# Altium schematic sheet 11_USB3.1 x4 HUB.SchDoc: C200
size 439 x 311 mm; Page Create Date: March  8, 1995; Page Number: 11; Page Size: Custom; Comment: radxa_1010; Page Count: 21; RevCode: V1.11; Doc: 11_USB3.1 x4 HUB; DsnPath: D:\WMS\C200\CC122\对外\C200 V1.11.DSN; SchematicName: c200; PageName: 11_USB3.1 x4 HUB; PageSize: Custom; TopSchematic: True
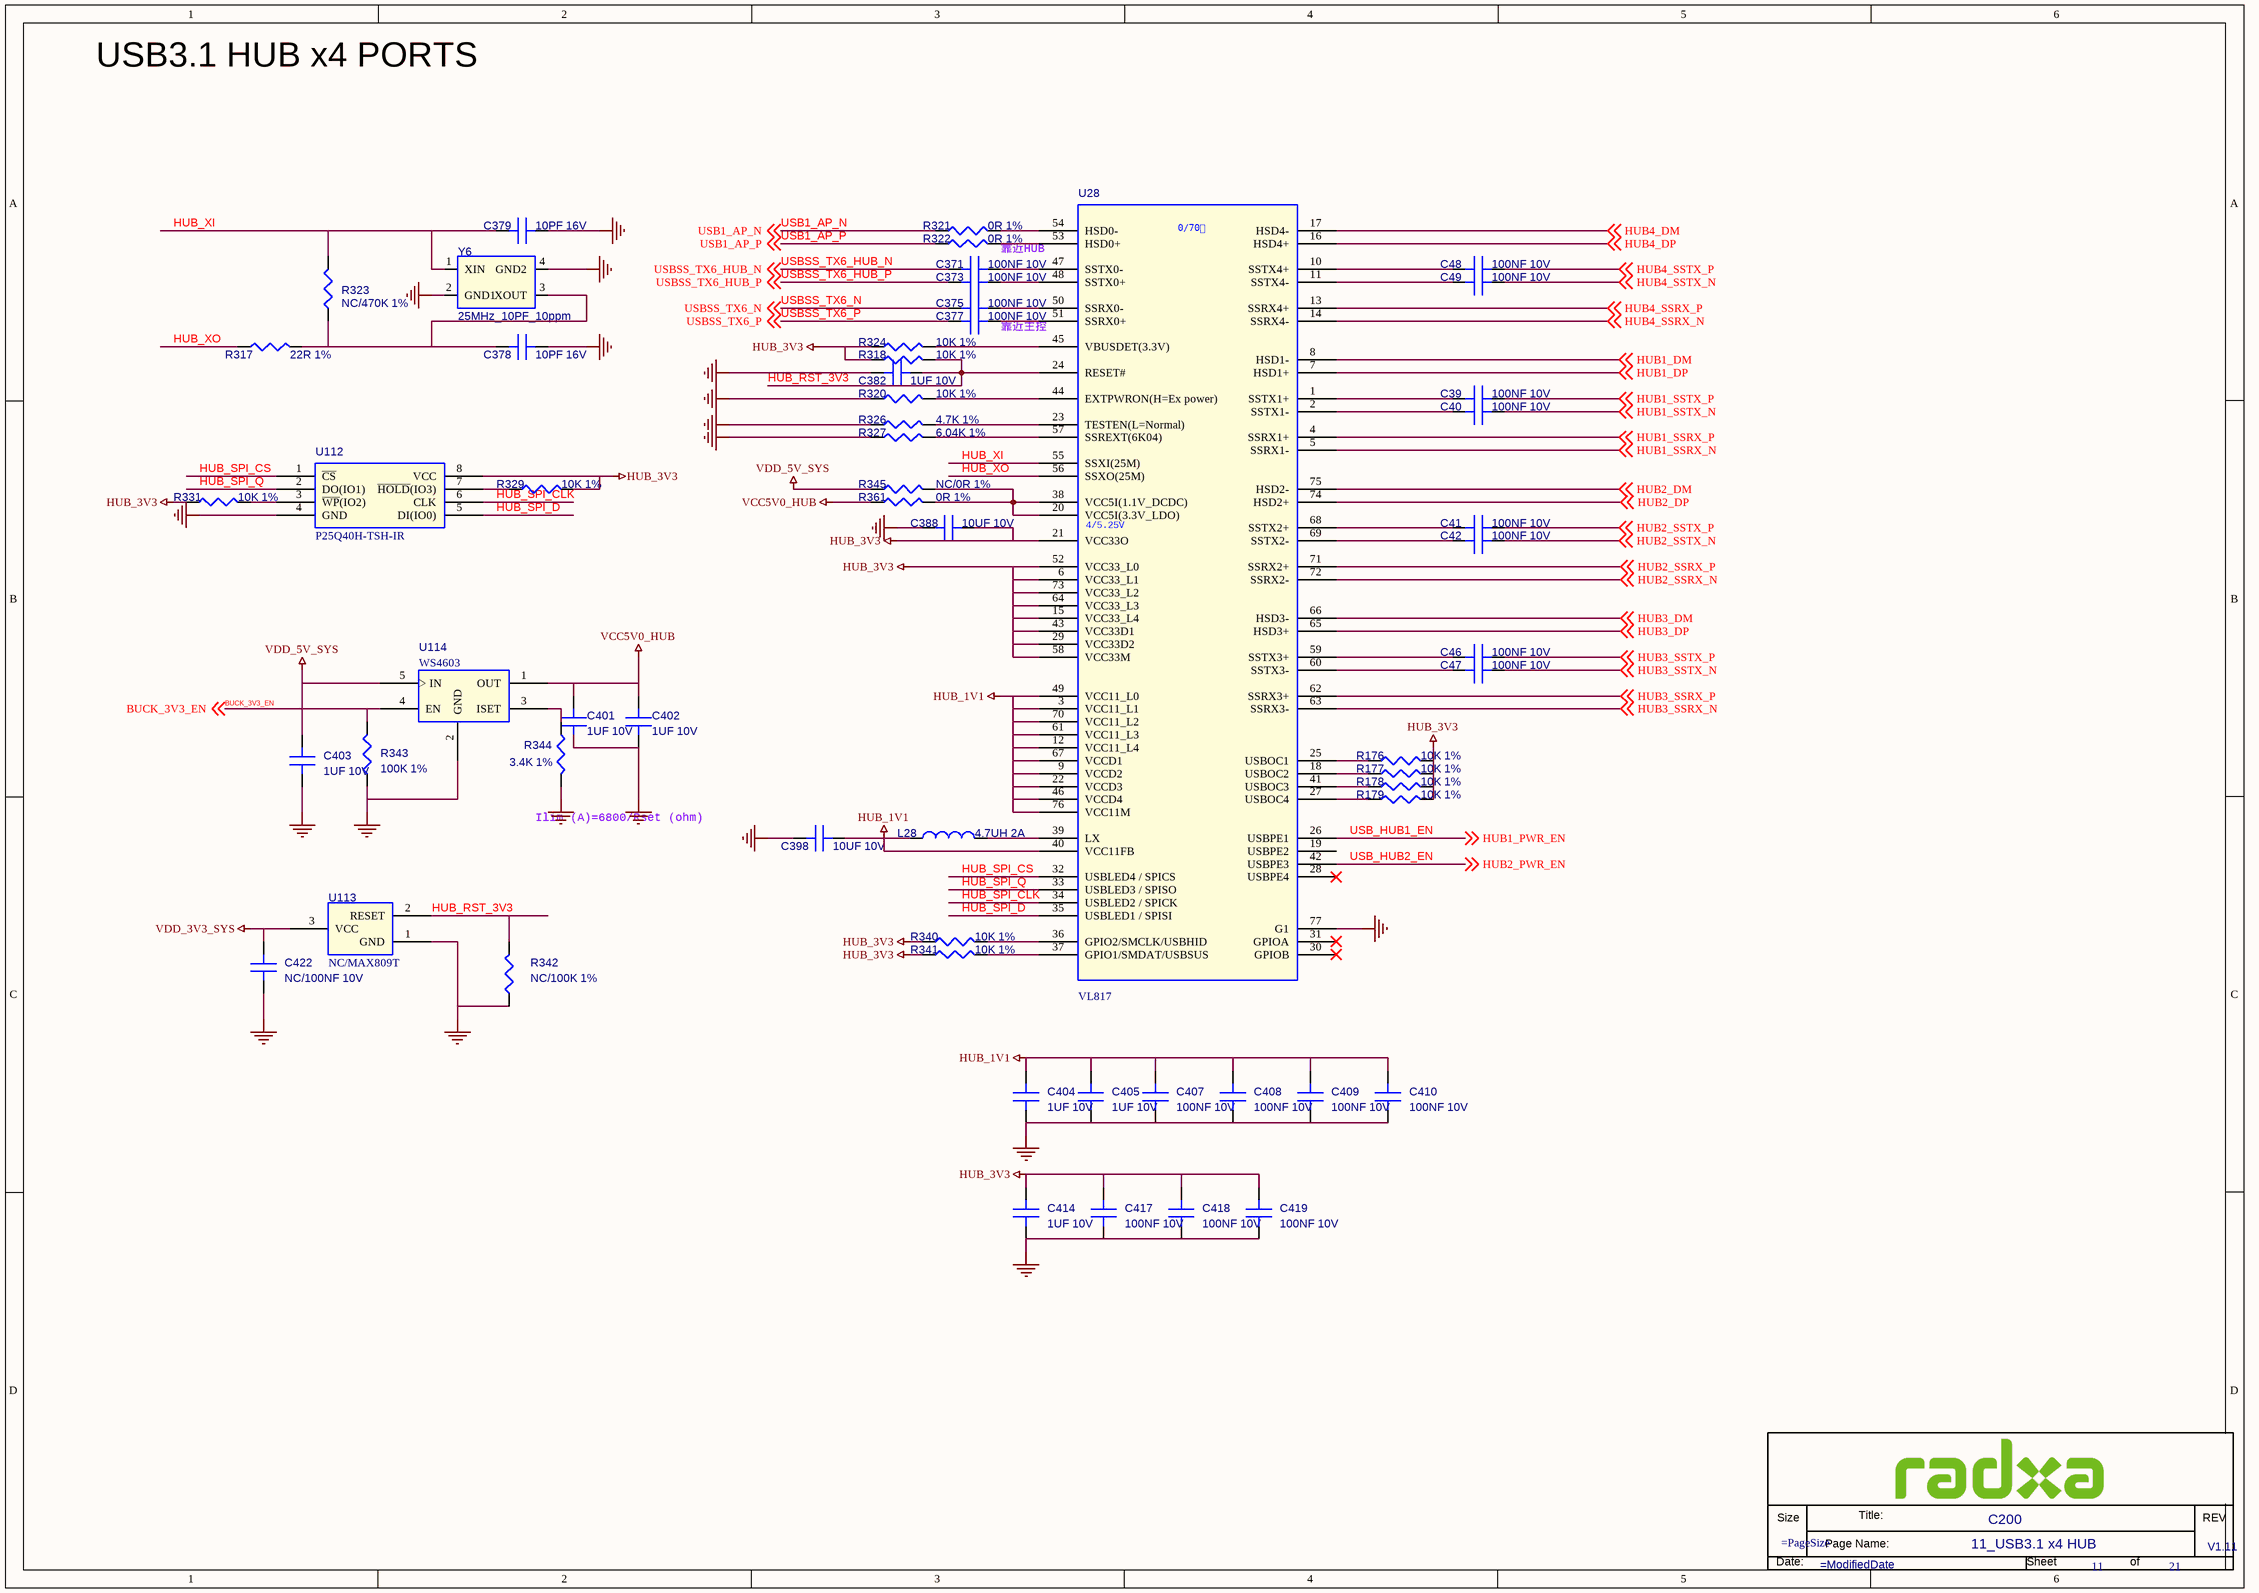
[diagram p0: 11_USB3.1 x4 HUB.SchDoc]

## Parts
*  Doc: 11_USB3.1 x4 HUB  RevCode: V1.11  Title: C200  Page Number: 11  Page Count: 21  (hidden comment: radxa_1010)  (graphical)
C39  100NF 10V  [C0402]
C40  100NF 10V  [C0402]
C41  100NF 10V  [C0402]
C42  100NF 10V  [C0402]
C46  100NF 10V  [C0402]
C47  100NF 10V  [C0402]
C48  100NF 10V  [C0402]
C49  100NF 10V  [C0402]
C371  100NF 10V  [C0402]
C373  100NF 10V  [C0402]
C375  100NF 10V  [C0402]
C377  100NF 10V  [C0402]
C378  10PF 16V  [C0402]
C379  10PF 16V  [C0402]
C382  1UF 10V  [C0402]
C388  10UF 10V  [C0603]
C398  10UF 10V  [C0603]
C401  1UF 10V  [C0402]
C402  1UF 10V  [C0402]
C403  1UF 10V  [C0402]
C404  1UF 10V  [C0402]
C405  1UF 10V  [C0402]
C407  100NF 10V  [C0402]
C408  100NF 10V  [C0402]
C409  100NF 10V  [C0402]
C410  100NF 10V  [C0402]
C414  1UF 10V  [C0402]
C417  100NF 10V  [C0402]
C418  100NF 10V  [C0402]
C419  100NF 10V  [C0402]
C422  NC/100NF 10V  [C0402]
L28  4.7UH 2A  [L_2520]
R176  10K 1%  [R0402]
R177  10K 1%  [R0402]
R178  10K 1%  [R0402]
R179  10K 1%  [R0402]
R317  22R 1%  [R0402]
R318  10K 1%  [R0402]
R320  10K 1%  [R0402]
R321  0R 1%  [R0402]
R322  0R 1%  [R0402]
R323  NC/470K 1%  [R0402]
R324  10K 1%  [R0402]
R326  4.7K 1%  [R0402]
R327  6.04K 1%  [R0402]
R329  10K 1%  [R0402]
R331  10K 1%  [R0402]
R340  10K 1%  [R0402]
R341  10K 1%  [R0402]
R342  NC/100K 1%  [R0402]
R343  100K 1%  [R0402]
R344  3.4K 1%  [R0402]
R345  NC/0R 1%  [R0402]
R361  0R 1%  [R0402]
U28  VL817  [QFN76E-PH04-9x9mm]
U112  P25Q40H-TSH-IR  [TSSOP8_0D65_4]
U113  NC/MAX809T  [SOT_23]
U114  WS4603  [SOT23_5]
Y6  25MHz_10PF_10ppm  [CRY-3225]

## Nets
GND: C378.1(A) C379.1(A) C382.1(A) C388.2(B) C398.2(B) C401.2(B) C402.2(B) C403.1(A) C404.2(B) C405.2(B) C407.2(B) C408.2(B) C409.2(B) C410.2(B) C414.2(B) C417.2(B) C418.2(B) C419.2(B) C422.2(B) R320.2 R326.2 R327.2 R342.2 R343.1 R344.1 U28.77(G1) U112.4(GND) U113.1(GND) U114.2(GND) Y6.2(GND1) Y6.4(GND2)
HUB_1V1: C398.1(A) C404.1(A) C405.1(A) C407.1(A) C408.1(A) C409.1(A) C410.1(A) L28.1 U28.3(VCC11_L1) U28.9(VCCD2) U28.12(VCC11_L4) U28.22(VCCD3) U28.40(VCC11FB) U28.46(VCCD4) U28.49(VCC11_L0) U28.61(VCC11_L3) U28.67(VCCD1) U28.70(VCC11_L2) U28.76(VCC11M)
HUB_3V3: C388.1(A) C414.1(A) C417.1(A) C418.1(A) C419.1(A) R176.2 R177.2 R178.2 R179.2 R318.2 R324.2 R329.1 R331.2 R340.2 R341.2 U28.6(VCC33_L1) U28.15(VCC33_L4) U28.21(VCC33O) U28.29(VCC33D2) U28.43(VCC33D1) U28.52(VCC33_L0) U28.58(VCC33M) U28.64(VCC33_L3) U28.73(VCC33_L2) U112.8(VCC)
VCC5V0_HUB: C401.1(A) C402.1(A) R361.2 U114.1(OUT)
VDD_3V3_SYS: C422.1(A) U113.3(VCC)
VDD_5V_SYS: C403.2(B) R345.2 U114.5(IN)
BUCK_3V3_EN: R343.2 U114.4(EN) ; off-sheet BUCK_3V3_EN
HUB1_DM: U28.8(HSD1-) ; off-sheet HUB1_DM
HUB1_DP: U28.7(HSD1+) ; off-sheet HUB1_DP
HUB1_SSRX_N: U28.5(SSRX1-) ; off-sheet HUB1_SSRX_N
HUB1_SSRX_P: U28.4(SSRX1+) ; off-sheet HUB1_SSRX_P
HUB1_SSTX_N: C40.2(B) ; off-sheet HUB1_SSTX_N
HUB1_SSTX_P: C39.2(B) ; off-sheet HUB1_SSTX_P
HUB2_DM: U28.75(HSD2-) ; off-sheet HUB2_DM
HUB2_DP: U28.74(HSD2+) ; off-sheet HUB2_DP
HUB2_SSRX_N: U28.72(SSRX2-) ; off-sheet HUB2_SSRX_N
HUB2_SSRX_P: U28.71(SSRX2+) ; off-sheet HUB2_SSRX_P
HUB2_SSTX_N: C42.2(B) ; off-sheet HUB2_SSTX_N
HUB2_SSTX_P: C41.2(B) ; off-sheet HUB2_SSTX_P
HUB3_DM: U28.66(HSD3-) ; off-sheet HUB3_DM
HUB3_DP: U28.65(HSD3+) ; off-sheet HUB3_DP
HUB3_SSRX_N: U28.63(SSRX3-) ; off-sheet HUB3_SSRX_N
HUB3_SSRX_P: U28.62(SSRX3+) ; off-sheet HUB3_SSRX_P
HUB3_SSTX_N: C47.2(B) ; off-sheet HUB3_SSTX_N
HUB3_SSTX_P: C46.2(B) ; off-sheet HUB3_SSTX_P
HUB4_DM: U28.17(HSD4-) ; off-sheet HUB4_DM
HUB4_DP: U28.16(HSD4+) ; off-sheet HUB4_DP
HUB4_SSRX_N: U28.14(SSRX4-) ; off-sheet HUB4_SSRX_N
HUB4_SSRX_P: U28.13(SSRX4+) ; off-sheet HUB4_SSRX_P
HUB4_SSTX_N: C49.2(B) ; off-sheet HUB4_SSTX_N
HUB4_SSTX_P: C48.2(B) ; off-sheet HUB4_SSTX_P
HUB_RST_3V3: C382.2(B) R318.1 R342.1 U28.24(RESET#) U113.2(RESET)
HUB_SPI_CLK: U28.34(USBLED2_/_SPICK) U112.6(CLK)
HUB_SPI_CS: U28.32(USBLED4_/_SPICS) U112.1(~{CS})
HUB_SPI_D: U28.35(USBLED1_/_SPISI) U112.5(DI(IO0))
HUB_SPI_Q: U28.33(USBLED3_/_SPISO) U112.2(DO(IO1))
HUB_XI: C379.2(B) R323.1 U28.55(SSXI(25M)) Y6.1(XIN)
HUB_XO: R317.2 U28.56(SSXO(25M))
USB1_AP_N: R321.2 ; off-sheet USB1_AP_N
USB1_AP_P: R322.2 ; off-sheet USB1_AP_P
USB_HUB1_EN: U28.26(USBPE1) ; off-sheet HUB1_PWR_EN  [also labelled HUB1_PWR_EN]
USB_HUB2_EN: U28.42(USBPE3) ; off-sheet HUB2_PWR_EN  [also labelled HUB2_PWR_EN]
USBSS_TX6_HUB_N: C371.2(B) ; off-sheet USBSS_TX6_HUB_N
USBSS_TX6_HUB_P: C373.2(B) ; off-sheet USBSS_TX6_HUB_P
USBSS_TX6_N: C375.2(B) ; off-sheet USBSS_TX6_N
USBSS_TX6_P: C377.2(B) ; off-sheet USBSS_TX6_P
NetC39_1: C39.1(A) U28.1(SSTX1+)
NetC40_1: C40.1(A) U28.2(SSTX1-)
NetC41_1: C41.1(A) U28.68(SSTX2+)
NetC42_1: C42.1(A) U28.69(SSTX2-)
NetC46_1: C46.1(A) U28.59(SSTX3+)
NetC47_1: C47.1(A) U28.60(SSTX3-)
NetC48_1: C48.1(A) U28.10(SSTX4+)
NetC49_1: C49.1(A) U28.11(SSTX4-)
NetC371_1: C371.1(A) U28.47(SSTX0-)
NetC373_1: C373.1(A) U28.48(SSTX0+)
NetC375_1: C375.1(A) U28.50(SSRX0-)
NetC377_1: C377.1(A) U28.51(SSRX0+)
NetC378_2: C378.2(B) R317.1 R323.2 Y6.3(XOUT)
NetL28_2: L28.2 U28.39(LX)
NetR176_1: R176.1 U28.25(USBOC1)
NetR177_1: R177.1 U28.18(USBOC2)
NetR178_1: R178.1 U28.41(USBOC3)
NetR179_1: R179.1 U28.27(USBOC4)
NetR320_1: R320.1 U28.44(EXTPWRON(H=Ex_power))
NetR321_1: R321.1 U28.54(HSD0-)
NetR322_1: R322.1 U28.53(HSD0+)
NetR324_1: R324.1 U28.45(VBUSDET(3.3V))
NetR326_1: R326.1 U28.23(TESTEN(L=Normal))
NetR327_1: R327.1 U28.57(SSREXT(6K04))
NetR329_2: R329.2 U112.7(~{HOLD}(IO3))
NetR331_1: R331.1 U112.3(~{WP}(IO2))
NetR340_1: R340.1 U28.36(GPIO2/SMCLK/USBHID)
NetR341_1: R341.1 U28.37(GPIO1/SMDAT/USBSUS)
NetR344_2: R344.2 U114.3(ISET)
NetR345_1: R345.1 R361.1 U28.20(VCC5I(3.3V_LDO)) U28.38(VCC5I(1.1V_DCDC))

Not connected (* = marked no-connect by the designer): U28 19(USBPE2) 28(USBPE4)* 30(GPIOB)* 31(GPIOA)*

## Notes on the sheet
- USB3.1 HUB x4 PORTS
- 靠近HUB
- 靠近主控
- (near R344) Ilim (A)=6800/Rset (ohm)
- (in symbol radxa_1010) Size; Title:; REV; Page Name:; Date:; Sheet; of
- (in symbol VL817) 0/70℃; 4/5.25V

## Library data of the parts
C39 = C: SMD  0402  100NF  10V  X5R  ±10%  ROHS; PARTS: 1; Part Reference: C39; Part Number: A1C01.00163; OriginalSymbolOrigin: (0,30); PKG_TYPE: CAP2-100-250; LEVEL: STD; PINSWAP: (A,B); Value: 100NF 10V; Part Type: 陶瓷电容; PCB Footprint: C0402
C40 = C: SMD  0402  100NF  10V  X5R  ±10%  ROHS; PARTS: 1; Part Reference: C40; Part Number: A1C01.00163; OriginalSymbolOrigin: (0,30); PKG_TYPE: CAP2-100-250; LEVEL: STD; PINSWAP: (A,B); Value: 100NF 10V; Part Type: 陶瓷电容; PCB Footprint: C0402
C41 = C: SMD  0402  100NF  10V  X5R  ±10%  ROHS; PARTS: 1; Part Reference: C41; Part Number: A1C01.00163; OriginalSymbolOrigin: (0,30); PKG_TYPE: CAP2-100-250; LEVEL: STD; PINSWAP: (A,B); Value: 100NF 10V; Part Type: 陶瓷电容; PCB Footprint: C0402
C42 = C: SMD  0402  100NF  10V  X5R  ±10%  ROHS; PARTS: 1; Part Reference: C42; Part Number: A1C01.00163; OriginalSymbolOrigin: (0,30); PKG_TYPE: CAP2-100-250; LEVEL: STD; PINSWAP: (A,B); Value: 100NF 10V; Part Type: 陶瓷电容; PCB Footprint: C0402
C46 = C: SMD  0402  100NF  10V  X5R  ±10%  ROHS; PARTS: 1; Part Reference: C46; Part Number: A1C01.00163; OriginalSymbolOrigin: (0,30); PKG_TYPE: CAP2-100-250; LEVEL: STD; PINSWAP: (A,B); Value: 100NF 10V; Part Type: 陶瓷电容; PCB Footprint: C0402
C47 = C: SMD  0402  100NF  10V  X5R  ±10%  ROHS; PARTS: 1; Part Reference: C47; Part Number: A1C01.00163; OriginalSymbolOrigin: (0,30); PKG_TYPE: CAP2-100-250; LEVEL: STD; PINSWAP: (A,B); Value: 100NF 10V; Part Type: 陶瓷电容; PCB Footprint: C0402
C48 = C: SMD  0402  100NF  10V  X5R  ±10%  ROHS; PARTS: 1; Part Reference: C48; Part Number: A1C01.00163; OriginalSymbolOrigin: (0,30); PKG_TYPE: CAP2-100-250; LEVEL: STD; PINSWAP: (A,B); Value: 100NF 10V; Part Type: 陶瓷电容; PCB Footprint: C0402
C49 = C: SMD  0402  100NF  10V  X5R  ±10%  ROHS; PARTS: 1; Part Reference: C49; Part Number: A1C01.00163; OriginalSymbolOrigin: (0,30); PKG_TYPE: CAP2-100-250; LEVEL: STD; PINSWAP: (A,B); Value: 100NF 10V; Part Type: 陶瓷电容; PCB Footprint: C0402
C371 = C: SMD  0402  100NF  10V  X5R  ±10%  ROHS; PARTS: 1; Part Reference: C371; Part Number: A1C01.00163; OriginalSymbolOrigin: (0,30); PKG_TYPE: CAP2-100-250; LEVEL: STD; PINSWAP: (A,B); Value: 100NF 10V; Part Type: 陶瓷电容; PCB Footprint: C0402
C373 = C: SMD  0402  100NF  10V  X5R  ±10%  ROHS; PARTS: 1; Part Reference: C373; Part Number: A1C01.00163; OriginalSymbolOrigin: (0,30); PKG_TYPE: CAP2-100-250; LEVEL: STD; PINSWAP: (A,B); Value: 100NF 10V; Part Type: 陶瓷电容; PCB Footprint: C0402
C375 = C: SMD  0402  100NF  10V  X5R  ±10%  ROHS; PARTS: 1; Part Reference: C375; Part Number: A1C01.00163; OriginalSymbolOrigin: (0,30); PKG_TYPE: CAP2-100-250; LEVEL: STD; PINSWAP: (A,B); Value: 100NF 10V; Part Type: 陶瓷电容; PCB Footprint: C0402
C377 = C: SMD  0402  100NF  10V  X5R  ±10%  ROHS; PARTS: 1; Part Reference: C377; Part Number: A1C01.00163; OriginalSymbolOrigin: (0,30); PKG_TYPE: CAP2-100-250; LEVEL: STD; PINSWAP: (A,B); Value: 100NF 10V; Part Type: 陶瓷电容; PCB Footprint: C0402
C378 = C: SMD  0402  10PF  16V  NPO  ±10%  ROHS; PARTS: 1; Part Reference: C378; Part Number: A1C01.00152; OriginalSymbolOrigin: (0,30); PKG_TYPE: CAP2-100-250; LEVEL: STD; PINSWAP: (A,B); Value: 10PF 16V; Part Type: 陶瓷电容; PCB Footprint: C0402
C379 = C: SMD  0402  10PF  16V  NPO  ±10%  ROHS; PARTS: 1; Part Reference: C379; Part Number: A1C01.00152; OriginalSymbolOrigin: (0,30); PKG_TYPE: CAP2-100-250; LEVEL: STD; PINSWAP: (A,B); Value: 10PF 16V; Part Type: 陶瓷电容; PCB Footprint: C0402
C382 = C: SMD  0402  1UF  10V  X5R  ±10%  ROHS; PARTS: 1; Part Reference: C382; Part Number: A1C01.00063; OriginalSymbolOrigin: (0,30); PKG_TYPE: CAP2-100-250; LEVEL: STD; PINSWAP: (A,B); Value: 1UF 10V; Part Type: 陶瓷电容; PCB Footprint: C0402
C388 = C: SMD  0603  10UF  10V  X5R  ±10%  ROHS; PARTS: 1; Part Reference: C388; Part Number: A1C01.00270; OriginalSymbolOrigin: (0,30); PKG_TYPE: CAP2-100-250; LEVEL: STD; PINSWAP: (A,B); Value: 10UF 10V; Part Type: 陶瓷电容; PCB Footprint: C0603
C398 = C: SMD  0603  10UF  10V  X5R  ±10%  ROHS; PARTS: 1; Part Reference: C398; Part Number: A1C01.00270; OriginalSymbolOrigin: (0,30); PKG_TYPE: CAP2-100-250; LEVEL: STD; PINSWAP: (A,B); Value: 10UF 10V; Part Type: 陶瓷电容; PCB Footprint: C0603
C401 = C: SMD  0402  1UF  10V  X5R  ±10%  ROHS; PARTS: 1; Part Reference: C401; Part Number: A1C01.00063; OriginalSymbolOrigin: (0,30); PKG_TYPE: CAP2-100-250; LEVEL: STD; PINSWAP: (A,B); Value: 1UF 10V; Part Type: 陶瓷电容; PCB Footprint: C0402
C402 = C: SMD  0402  1UF  10V  X5R  ±10%  ROHS; PARTS: 1; Part Reference: C402; Part Number: A1C01.00063; OriginalSymbolOrigin: (0,30); PKG_TYPE: CAP2-100-250; LEVEL: STD; PINSWAP: (A,B); Value: 1UF 10V; Part Type: 陶瓷电容; PCB Footprint: C0402
C403 = C: SMD  0402  1UF  10V  X5R  ±10%  ROHS; PARTS: 1; Part Reference: C403; Part Number: A1C01.00063; OriginalSymbolOrigin: (0,30); PKG_TYPE: CAP2-100-250; LEVEL: STD; PINSWAP: (A,B); Value: 1UF 10V; Part Type: 陶瓷电容; PCB Footprint: C0402
C404 = C: SMD  0402  1UF  10V  X5R  ±10%  ROHS; PARTS: 1; Part Reference: C404; Part Number: A1C01.00063; OriginalSymbolOrigin: (0,30); PKG_TYPE: CAP2-100-250; LEVEL: STD; PINSWAP: (A,B); Value: 1UF 10V; Part Type: 陶瓷电容; PCB Footprint: C0402
C405 = C: SMD  0402  1UF  10V  X5R  ±10%  ROHS; PARTS: 1; Part Reference: C405; Part Number: A1C01.00063; OriginalSymbolOrigin: (0,30); PKG_TYPE: CAP2-100-250; LEVEL: STD; PINSWAP: (A,B); Value: 1UF 10V; Part Type: 陶瓷电容; PCB Footprint: C0402
C407 = C: SMD  0402  100NF  10V  X5R  ±10%  ROHS; PARTS: 1; Part Reference: C407; Part Number: A1C01.00163; OriginalSymbolOrigin: (0,30); PKG_TYPE: CAP2-100-250; LEVEL: STD; PINSWAP: (A,B); Value: 100NF 10V; Part Type: 陶瓷电容; PCB Footprint: C0402
C408 = C: SMD  0402  100NF  10V  X5R  ±10%  ROHS; PARTS: 1; Part Reference: C408; Part Number: A1C01.00163; OriginalSymbolOrigin: (0,30); PKG_TYPE: CAP2-100-250; LEVEL: STD; PINSWAP: (A,B); Value: 100NF 10V; Part Type: 陶瓷电容; PCB Footprint: C0402
C409 = C: SMD  0402  100NF  10V  X5R  ±10%  ROHS; PARTS: 1; Part Reference: C409; Part Number: A1C01.00163; OriginalSymbolOrigin: (0,30); PKG_TYPE: CAP2-100-250; LEVEL: STD; PINSWAP: (A,B); Value: 100NF 10V; Part Type: 陶瓷电容; PCB Footprint: C0402
C410 = C: SMD  0402  100NF  10V  X5R  ±10%  ROHS; PARTS: 1; Part Reference: C410; Part Number: A1C01.00163; OriginalSymbolOrigin: (0,30); PKG_TYPE: CAP2-100-250; LEVEL: STD; PINSWAP: (A,B); Value: 100NF 10V; Part Type: 陶瓷电容; PCB Footprint: C0402
C414 = C: SMD  0402  1UF  10V  X5R  ±10%  ROHS; PARTS: 1; Part Reference: C414; Part Number: A1C01.00063; OriginalSymbolOrigin: (0,30); PKG_TYPE: CAP2-100-250; LEVEL: STD; PINSWAP: (A,B); Value: 1UF 10V; Part Type: 陶瓷电容; PCB Footprint: C0402
C417 = C: SMD  0402  100NF  10V  X5R  ±10%  ROHS; PARTS: 1; Part Reference: C417; Part Number: A1C01.00163; OriginalSymbolOrigin: (0,30); PKG_TYPE: CAP2-100-250; LEVEL: STD; PINSWAP: (A,B); Value: 100NF 10V; Part Type: 陶瓷电容; PCB Footprint: C0402
C418 = C: SMD  0402  100NF  10V  X5R  ±10%  ROHS; PARTS: 1; Part Reference: C418; Part Number: A1C01.00163; OriginalSymbolOrigin: (0,30); PKG_TYPE: CAP2-100-250; LEVEL: STD; PINSWAP: (A,B); Value: 100NF 10V; Part Type: 陶瓷电容; PCB Footprint: C0402
C419 = C: SMD  0402  100NF  10V  X5R  ±10%  ROHS; PARTS: 1; Part Reference: C419; Part Number: A1C01.00163; OriginalSymbolOrigin: (0,30); PKG_TYPE: CAP2-100-250; LEVEL: STD; PINSWAP: (A,B); Value: 100NF 10V; Part Type: 陶瓷电容; PCB Footprint: C0402
C422 = C: SMD  0402  100NF  10V  X5R  ±10%  ROHS; PARTS: 1; Part Reference: C422; Part Number: A1C01.00163; OriginalSymbolOrigin: (0,30); PKG_TYPE: CAP2-100-250; LEVEL: STD; PINSWAP: (A,B); Value: NC/100NF 10V; Part Type: 陶瓷电容; PCB Footprint: C0402
L28 = L: SMD  带屏蔽  2.5*2.0*1.0mm  4.7UH  2A  ±20%  FTC252010S4R7MBCA  cjiang(长江微电)  ROHS; Part Reference: L28; Part Number: A1L01.00169; PCB Footprint: L_2520; Value: 4.7UH 2A; Part Type: 贴片功率电感
R176 = R: SMD  0201  10K  1/20W  ±1%  ROHS; Part Reference: R176; Part Number: A1R01.00060; PCB Footprint: R0201; Preferred: 优选; Value: 10K 1%; Part Type: 贴片电阻
R177 = R: SMD  0201  10K  1/20W  ±1%  ROHS; Part Reference: R177; Part Number: A1R01.00060; PCB Footprint: R0201; Preferred: 优选; Value: 10K 1%; Part Type: 贴片电阻
R178 = R: SMD  0201  10K  1/20W  ±1%  ROHS; Part Reference: R178; Part Number: A1R01.00060; PCB Footprint: R0201; Preferred: 优选; Value: 10K 1%; Part Type: 贴片电阻
R179 = R: SMD  0201  10K  1/20W  ±1%  ROHS; Part Reference: R179; Part Number: A1R01.00060; PCB Footprint: R0201; Preferred: 优选; Value: 10K 1%; Part Type: 贴片电阻
R317 = R: SMD  0402  22R  1/16W  ±1%  ROHS; Part Reference: R317; Part Number: A1R01.00408; PCB Footprint: R0402; Value: 22R 1%; Part Type: 贴片电阻
R318 = R: SMD  0402  10K  1/16W  ±1%  ROHS; Part Reference: R318; Part Number: A1R01.00222; PCB Footprint: R0402; Value: 10K 1%; Part Type: 贴片电阻
R320 = R: SMD  0402  10K  1/16W  ±1%  ROHS; Part Reference: R320; Part Number: A1R01.00222; PCB Footprint: R0402; Value: 10K 1%; Part Type: 贴片电阻
R321 = R: SMD  0402  0R  1/16W  ±1%  ROHS; Part Reference: R321; Part Number: A1R01.00219; PCB Footprint: R0402; Value: 0R 1%; Part Type: 贴片电阻
R322 = R: SMD  0402  0R  1/16W  ±1%  ROHS; Part Reference: R322; Part Number: A1R01.00219; PCB Footprint: R0402; Value: 0R 1%; Part Type: 贴片电阻
R323 = R: SMD  0402  470K  1/16W  ±1%  ROHS; Part Reference: R323; Part Number: A1R01.00305; PCB Footprint: R0402; Value: NC/470K 1%; Part Type: 贴片电阻
R324 = R: SMD  0402  10K  1/16W  ±1%  ROHS; Part Reference: R324; Part Number: A1R01.00222; PCB Footprint: R0402; Value: 10K 1%; Part Type: 贴片电阻
R326 = R: SMD  0402  4.7K  1/16W  ±1%  ROHS; Part Reference: R326; Part Number: A1R01.00250; PCB Footprint: R0402; Value: 4.7K 1%; Part Type: 贴片电阻
R327 = R: SMD  0402  6.04K  1/20W  ±1%  ROHS; Part Reference: R327; Part Number: A1R01.00515; Temp Coeff: -55℃~+155℃; PCB Footprint: R0402; Value: 6.04K 1%; Part Type: 贴片电阻
R329 = R: SMD  0402  10K  1/16W  ±1%  ROHS; Part Reference: R329; Part Number: A1R01.00222; PCB Footprint: R0402; Value: 10K 1%; Part Type: 贴片电阻
R331 = R: SMD  0402  10K  1/16W  ±1%  ROHS; Part Reference: R331; Part Number: A1R01.00222; PCB Footprint: R0402; Value: 10K 1%; Part Type: 贴片电阻
R340 = R: SMD  0402  10K  1/16W  ±1%  ROHS; Part Reference: R340; Part Number: A1R01.00222; PCB Footprint: R0402; Value: 10K 1%; Part Type: 贴片电阻
R341 = R: SMD  0402  10K  1/16W  ±1%  ROHS; Part Reference: R341; Part Number: A1R01.00222; PCB Footprint: R0402; Value: 10K 1%; Part Type: 贴片电阻
R342 = R: SMD  0402  100K  1/16W  ±1%  ROHS; Part Reference: R342; Part Number: A1R01.00031; Temp Coeff: －55℃ ~ ＋155℃; PCB Footprint: R0402; Value: NC/100K 1%; Part Type: 贴片电阻
R343 = R: SMD  0402  100K  1/16W  ±1%  ROHS; Part Reference: R343; Part Number: A1R01.00031; Temp Coeff: －55℃ ~ ＋155℃; PCB Footprint: R0402; Value: 100K 1%; Part Type: 贴片电阻
R344 = R: SMD  0402  3.4K  1/16W  ±1%  ROHS; Part Reference: R344; Part Number: A1R01.00506; PCB Footprint: R0402; Value: 3.4K 1%; Part Type: 贴片电阻
R345 = R: SMD  0402  0R  1/16W  ±1%  ROHS; Part Reference: R345; Part Number: A1R01.00219; PCB Footprint: R0402; Value: NC/0R 1%; Part Type: 贴片电阻
R361 = R: SMD  0402  0R  1/16W  ±1%  ROHS; Part Reference: R361; Part Number: A1R01.00219; PCB Footprint: R0402; Value: 0R 1%; Part Type: 贴片电阻
U28 = VL817: SMD  USB 3.1 四端口输入  VL817  第1代集线器控制器  QFN76  VIA Technologies(威盛)  ROHS; Part Reference: U28; Part Number: A1I01.00687; Parameter: USB3.0 HUB芯片-VL817 QFN76; PCB Footprint: QFN76_0D4_9; Value: VL817; Part Type: 集成电路/模块
U112 = P25Q40H_TSH_IR: SMD  Flash  P25Q40H-TSH-IR  4Mb  2.3V~3.6V  TSSOP-8  PUYA(普冉)  ROHS; Part Reference: U112; Part Number: A1I01.00693; Parameter: SPI flash-比派USB HUB芯片配套flash P25Q40H; Temp Coeff: -40°C to +85°C; Value: P25Q40H-TSH-IR; Part Type: 集成电路/模块; PCB Footprint: TSSOP8_0D65_4
U113 = MAX809T: SMD  复位芯片  MAX809T  低电平有效,阈值电压3.08V,VIN 5.5V  SOT-23  UMW(友台半导体)  ROHS; Part Reference: U113; Part Number: A1I01.00764; Temp Coeff: -40℃~85℃; Value: NC/MAX809T; Part Type: 集成电路/模块; PCB Footprint: SOT_23
U114 = WS4603: SMD  功率开关  WS4603E-5/TR  1.25H  SOT-23-5L  ROHS; Part Reference: U114; Part Number: A1I01.00241; Parameter: SOT23-5; ID: U-IC0020; Temp Coeff: -40℃ to 85℃; Value: WS4603; Part Type: 集成电路/模块; PCB Footprint: SOT23_5
Y6 = OSC_4P: SMD编带  无源  3225  25MHz  10PF  ±10ppm  ROHS; Part Reference: Y6; Part Number: A1Y01.00017; PCB Footprint: OSC_SM4_3D2X2D5; Value: 25MHz_10PF_10ppm; Part Type: 晶振
* = radxa_1010: Page Create Date: March  8, 1995; Page Size: =PageSize; Page Modify Date: =ModifiedDate